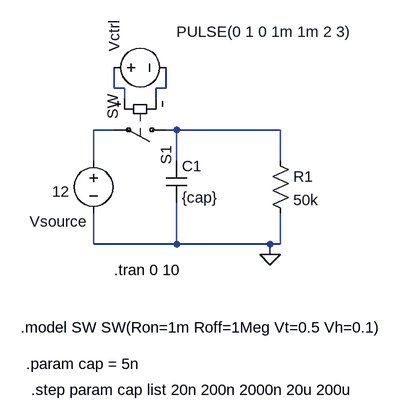
[diagram p0: schematic RC-with-switch.asc]
RC-with-switch.asc, the LTspice schematic file:
Version 4.1
SHEET 1 880 680
WIRE 64 16 64 -16
WIRE 80 16 64 16
WIRE 144 16 144 -16
WIRE 144 16 128 16
WIRE 80 32 80 16
WIRE 128 32 128 16
WIRE 64 80 32 80
WIRE 160 80 144 80
WIRE 320 80 160 80
WIRE 32 128 32 80
WIRE 160 128 160 80
WIRE 320 128 320 80
WIRE 32 256 32 208
WIRE 160 256 160 192
WIRE 160 256 32 256
WIRE 304 256 160 256
WIRE 320 256 320 208
WIRE 320 256 304 256
WIRE 304 272 304 256
FLAG 304 272 0
SYMBOL voltage 32 112 R0
WINDOW 0 -98 109 Left 2
WINDOW 3 -64 63 Left 2
WINDOW 123 0 0 Left 0
WINDOW 39 0 0 Left 0
SYMATTR InstName Vsource
SYMATTR Value 12
SYMBOL res 304 112 R0
SYMATTR InstName R1
SYMATTR Value 50k
SYMBOL cap 144 128 R0
SYMATTR InstName C1
SYMATTR Value {cap}
SYMBOL sw 160 80 R90
WINDOW 3 -54 98 Left 2
SYMATTR InstName S1
SYMBOL voltage 48 -16 R270
WINDOW 3 55 112 VRight 2
WINDOW 123 0 0 Left 0
WINDOW 39 0 0 Left 0
SYMATTR InstName Vctrl
SYMATTR Value PULSE(0 1 0 1m 1m 2 3)
TEXT 64 296 Left 2 !.tran 0 10
TEXT -80 384 Left 2 !.model SW SW(Ron=1m Roff=1Meg Vt=0.5 Vh=0.1)
TEXT -72 440 Left 2 !.param cap = 5n
TEXT -64 480 Left 2 !.step param cap list 20n 200n 2000n 20u 200u

The netlist it stands for:
* RC-with-switch.asc
Vsource N003 0 12
R1 N004 0 50k
C1 N004 0 {cap}
S1 N004 N003 N001 N002 SW
Vctrl N001 N002 PULSE(0 1 0 1m 1m 2 3)
.tran 0 10
.model SW SW(Ron=1m Roff=1Meg Vt=0.5 Vh=0.1)
.param cap = 5n
.step param cap list 20n 200n 2000n 20u 200u
.backanno
.end